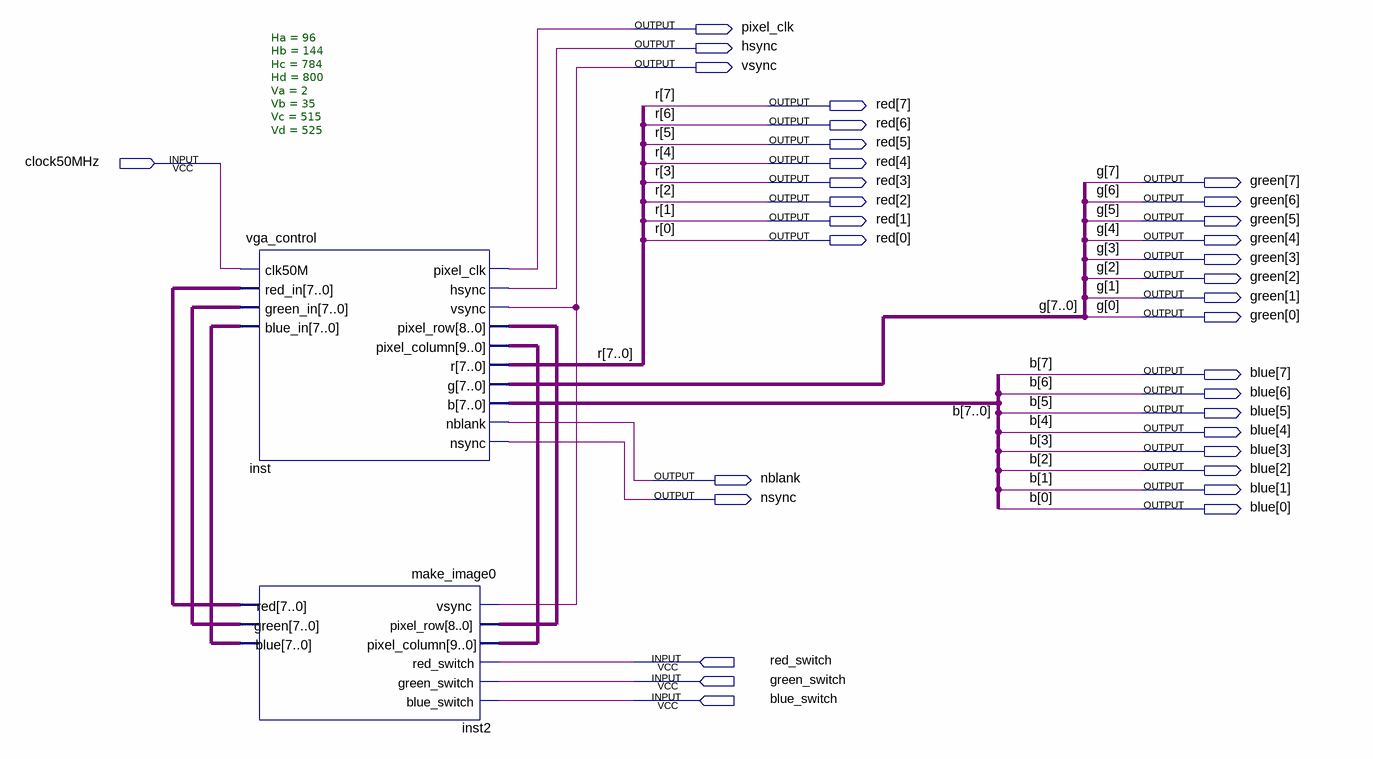
[diagram p0: schematic sheet]
// Quartus schematic VGA_lab.bdf as structural Verilog: 2 symbols, 33 pins
module VGA_lab (
  input  clock50MHz,
  input  red_switch,
  input  green_switch,
  input  blue_switch,
  output pixel_clk,
  output hsync,
  output vsync,
  output [7:0] red,
  output [7:0] green,
  output [7:0] blue,
  output nblank,
  output nsync
);

  wire [7:0] inst2_blue, inst2_green, inst2_red;
  wire [8:0] inst_pixel_row;
  wire [9:0] inst_pixel_column;

  vga_control #(.Ha(96), .Hb(144), .Hc(784), .Hd(800), .Va(2), .Vb(35), .Vc(515), .Vd(525)) inst (
    .clk50M(clock50MHz), .red_in(inst2_red), .green_in(inst2_green), .blue_in(inst2_blue),
    .pixel_clk(pixel_clk), .hsync(hsync), .vsync(vsync), .pixel_row(inst_pixel_row),
    .pixel_column(inst_pixel_column), .r(red), .g(green), .b(blue), .nblank(nblank), .nsync(nsync));
  make_image0 inst2 (
    .vsync(vsync), .pixel_row(inst_pixel_row), .pixel_column(inst_pixel_column), .red_switch(red_switch),
    .green_switch(green_switch), .blue_switch(blue_switch), .red(inst2_red), .green(inst2_green),
    .blue(inst2_blue));

  // Other names for the same wires on the sheet: b[7:0] = blue; g[7:0] = green; r[7:0] = red
endmodule
